# Altium schematic sheet USB_OTG_FS.SchDoc: USB OTG FS with Micro A-B connector
size A4; Date: 25-FEB-2015; Author: A.B; CompanyName: STMicroelectronics; Address1: 12, Rue Jules HOROWITZ; Address2: 38019 Grenoble; Address3: FRANCE; DocumentNumber: MB1191; Revision: B-02; SheetNumber: 9; SheetTotal: 14; Project: STM32F746G-DISCO
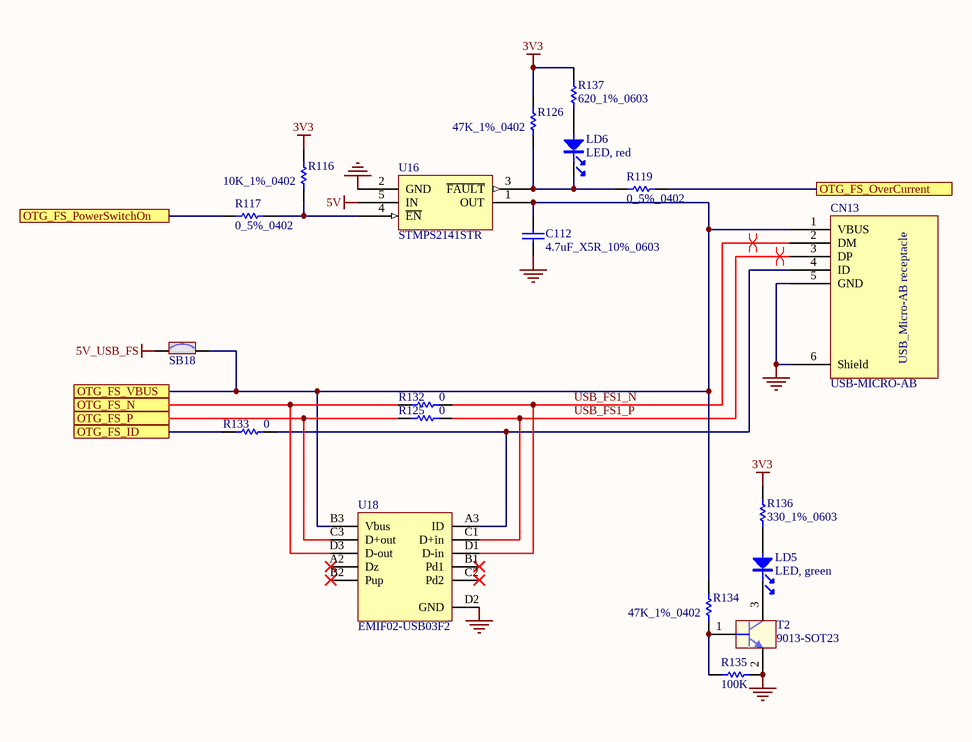
[diagram p0: USB_OTG_FS.SchDoc]

## Parts
C112  4.7uF_X5R_10%_0603  [0603C]
CN13  USB-MICRO-AB  [USB-MICRO-AB]
LD5  LED, green  [0603D]
LD6  LED, red  [0603D]
R116  10K_1%_0402  [0402R]
R117  0_5%_0402  [0402R]
R119  0_5%_0402  [0402R]
R125  0  [0402R]
R126  47K_1%_0402  [0402R]
R132  0  [0402R]
R133  0  [0402R]
R134  47K_1%_0402  [0402R]
R135  100K  [0402R]
R136  330_1%_0603  [0603R]
R137  620_1%_0603  [0603R]
SB18  Solder Bridge ON  [JP2_SMD]  (value not drawn)
T2  9013-SOT23  [SOT23]
U16  STMPS2141STR  [SOT23-5L]
U18  EMIF02-USB03F2  [Flip Chip]

## Ports
OTG_FS_ID, OTG_FS_N, OTG_FS_OverCurrent, OTG_FS_P, OTG_FS_PowerSwitchOn, OTG_FS_VBUS

## Nets
3V3: R116.2 R126.2 R136.2 R137.2
5V: U16.5(IN)
5V_USB_FS: SB18.1
GND: C112.1 CN13.5(GND) CN13.6(Shield) R135.2 T2.2(E) U16.2(GND) U18.D2(GND)
OTG_FS_ID: R133.1 ; port OTG_FS_ID
OTG_FS_N: R132.1 U18.D3(D-out) ; port OTG_FS_N
OTG_FS_OverCurrent: R119.2 ; port OTG_FS_OverCurrent
OTG_FS_P: R125.1 U18.C3(D+out) ; port OTG_FS_P
OTG_FS_PowerSwitchOn: R117.1 ; port OTG_FS_PowerSwitchOn
OTG_FS_VBUS: C112.2 CN13.1(VBUS) R134.2 SB18.2 U16.1(OUT) U18.B3(Vbus) ; port OTG_FS_VBUS
USB_FS1_N: CN13.2(DM) R132.2 U18.D1(D-in)
USB_FS1_P: CN13.3(DP) R125.2 U18.C1(D+in)
NetCN13_4: CN13.4(ID) R133.2 U18.A3(ID)
NetLD5_1: LD5.1 R136.1
NetLD5_2: LD5.2 T2.3(C)
NetLD6_1: LD6.1 R137.1
NetLD6_2: LD6.2 R119.1 R126.1 U16.3(~{FAULT})
NetR116_1: R116.1 R117.2 U16.4(~{EN})
NetR134_1: R134.1 R135.1 T2.1(B)

Not connected (* = marked no-connect by the designer): U18 A2(Dz)* B1(Pd1)* B2(Pup)* C2(Pd2)*

## Layout directives
differential pair: USB_FS1_N, USB_FS1_P

## Notes on the sheet
- Title:
- Project:
- Size:
- Revision:
- Variant:
- A4
- -
- Date:
- Reference:
- Sheet:
- of
- (in symbol USB-MICRO-AB) USB_Micro-AB receptacle

## Library data of the parts
C112 = Cap_4.7uF_X5R_10%_0603: Capacitor,4.7uF,16V, X5R,10%,0603,YAGEO; Manuf_Part_1: CC0603KRX5R7BB475; Order: CC0603KRX5R7BB105; Revision: July-2002: Re-released for DXP Platform.; Value: 4.7uF; Manuf_1: YAGEO; ECCN_US/EU: n/a
CN13 = USB-MICRO-AB: USB-MICRO-AB, 47590-0001, SMT, MOLEX; Ref St: xxxxxxx; Manuf_1: MOLEX; Manuf_Part_1: 47590-0001; ECCN_US/EU: n/a; Distrib: *
LD5 = LED_green: LED, green, 0603; Manuf_1: everlight; Manuf_Part_1: 19-213SYGC/S530-E2/TR8; ECCN_US/EU: EAR99/NEC; Order: 19-213SYGC/S530-E2/TR8
LD6 = LED_red: LED, red, 0603; Manuf_1: everlight; Manuf_Part_1: 19-217/R6C-AL1M2VY/3T; ECCN_US/EU: EAR99/NEC; Order: 19-217/R6C-AL1M2VY/3T
R116 = Res_10K_1%_0402: Resistor,10K,0402,1%,YAGEO; Manuf_Part_1: RC0402FR-0710KL; Value: 10K; Manuf_1: YAGEO; Order: RC0402FR-0710KL; ECCN_US/EU: n/a
R117 R119 = Res_0_5%_0402: Resistor,0,0402,5%,YAGEO; Manuf_Part_1: RC0402JR-070RL; Value: 0; Order: 2363467; ECCN_US/EU: n/a; Manuf_1: YAGEO; Distrib: FARNELL
R125 R132 R133 = Res_0_5%_0402: Resistor,0,0402,5%,YAGEO; Manuf_Part_1: RC0402JR-070RL; Order: 2363467; Value: 0; ECCN_US/EU: n/a; Manuf_1: YAGEO; Distrib: FARNELL
R126 R134 = Res_47K_1%_0402: Resistor,47K,0402,1%,YAGEO; Manuf_Part_1: RC0402FR-0747KL; Order: 9239430; Value: 47K; Manuf_1: YAGEO; ECCN_US/EU: n/a; Distrib: FARNELL
R135 = Res_100K_1%_0402: Resistor,100K,0402,1%,YAGEO; Manuf_Part_1: RT0402FRE07100KL; Value: 100K; Manuf_1: YAGEO; Order: RT0402FRE07100KL; ECCN_US/EU: n/a
R136 = Res_330_1%_0603: Resistor,330,0603,1%,YAGEO; Manuf_Part_1: RT0603FRE07330RL; Value: 330; Order: 1500622RL; ECCN_US/EU: n/a; Manuf_1: YAGEO; Distrib: FARNELL
R137 = Res_620_1%_0603: Resistor,620,0603,1%,VISHAY; Manuf_Part_1: CRCW0603620RFKEA; Manuf_1: VISHAY DRALORIC; Value: 620; Order: 2122341; ECCN_US/EU: n/a; Distrib: FARNELL
SB18 = SB_ON: Solder: YES; Revision: July-2002: Re-released for DXP Platform.; ECCN_US/EU: n/a
T2 = 9013-SOT23: NPN Bipolar Transistor; Manuf_1: NXP; Manuf_Part_1: BSR14; Order: 1081310; ECCN_US/EU: EAR99/NEC; Revision: July-2002: Re-released for DXP Platform.; Distrib: FARNELL
U16 = STMPS2141STR: Enhanced single channel power switches; Manuf_1: STM; Provided: ST; ECCN_US/EU: EAR99/NEC; Ref St: 9159003; Order: STMPS2141STR; Manuf_Part_1: STMPS2141STR; Distrib: ST
U18 = EMIF02-USB03F2: 2-line IPAD, EMI filter including ESD protection; Manuf_1: STM; Provided: ST; ECCN_US/EU: EAR99/NEC; Ref St: 9179037; Order: EMIF02-USB03F2; Manuf_Part_1: EMIF02-USB03F2; Distrib: ST